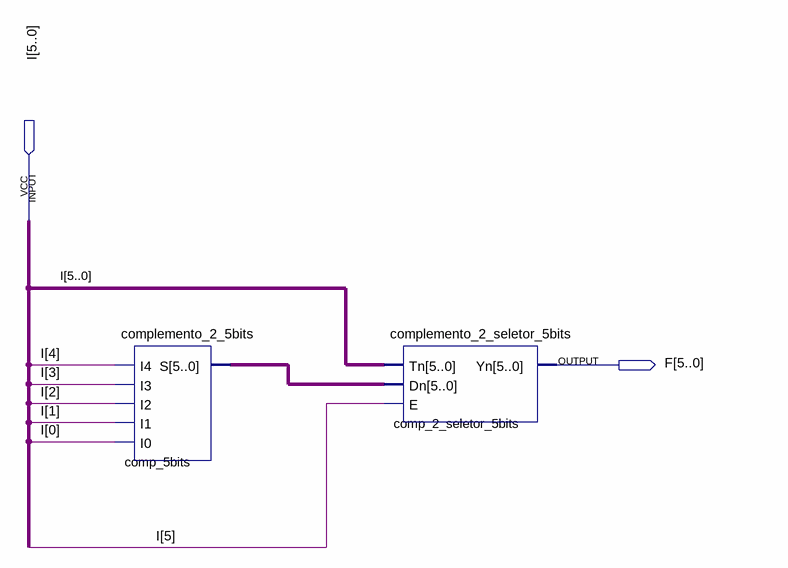
[diagram p0: schematic sheet]
// Quartus schematic complemento_2_checagem_saida.bdf as structural Verilog: 2 symbols, 2 pins
module complemento_2_checagem_saida (
  input  [5:0] I,
  output [5:0] F
);

  wire [5:0] comp_5bits_s;

  complemento_2_5bits comp_5bits (.I4(I[4]), .I3(I[3]), .I2(I[2]), .I1(I[1]), .I0(I[0]), .S(comp_5bits_s));
  complemento_2_seletor_5bits comp_2_seletor_5bits (.Tn(I), .Dn(comp_5bits_s), .E(I[5]), .Yn(F));
endmodule
